# Altium project lesson10.PrjPcb
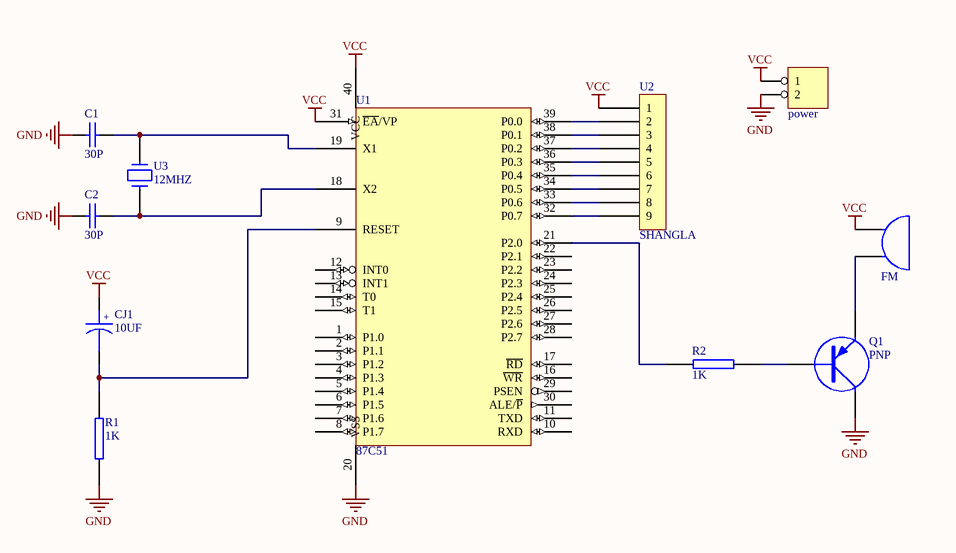
[diagram p0: lesson10.SchDoc]
1 sheet, 11 parts. Net scope: global (net labels, ports and power ports of the same name join across sheets).

## Sheet lesson10.SchDoc
size A4

### Parts
C1  30P  [0805]
C2  30P  [0805]
CJ1  10UF  [CD4]
FM  BUZZER  [LB2]  (value not drawn)
power  P2  [HDR1X2]  (value not drawn)
Q1  PNP  [SOT-23]
R1  1K  [0805]
R2  1K  [0805]
U1  87C51  [DIP40]
U2  SHANGLA  [shangla]
U3  12MHZ  [JZ]

### Nets
GND: C1.2 C2.2 power.2 Q1.2 R1.1 U1.20(VSS)  [also labelled VSS]
VCC: CJ1.1 FM.1(A) power.1 U1.31(~{EA}/VP) U1.40(VCC) U2.1
NetC1_1: C1.1 U1.19(X1) U3.2
NetC2_1: C2.1 U1.18(X2) U3.1
NetCJ1_2: CJ1.2 R1.2 U1.9(RESET)
NetFM_2: FM.2(B) Q1.3
NetQ1_1: Q1.1 R2.2
NetR2_1: R2.1 U1.21(P2.0)
NetU1_32: U1.32(P0.7) U2.9
NetU1_33: U1.33(P0.6) U2.8
NetU1_34: U1.34(P0.5) U2.7
NetU1_35: U1.35(P0.4) U2.6
NetU1_36: U1.36(P0.3) U2.5
NetU1_37: U1.37(P0.2) U2.4
NetU1_38: U1.38(P0.1) U2.3
NetU1_39: U1.39(P0.0) U2.2

Not connected (* = marked no-connect by the designer): U1 1(P1.0) 2(P1.1) 3(P1.2) 4(P1.3) 5(P1.4) 6(P1.5) 7(P1.6) 8(P1.7) 10(RXD) 11(TXD) 12(INT0) 13(INT1) 14(T0) 15(T1) 16(~{WR}) 17(~{RD}) 22(P2.1) 23(P2.2) 24(P2.3) 25(P2.4) 26(P2.5) 27(P2.6) 28(P2.7) 29(PSEN) 30(ALE/~{P})

### Notes on the sheet
- (in symbol CAPACITOR POL) +

### Library data of the parts
C1 C2 = CAP: Capacitor
CJ1 = CAPACITOR POL: Capacitor
power = HEADER 2
Q1 = PNP: PNP Transistor
R1 R2 = RES2
U3 = CRYSTAL